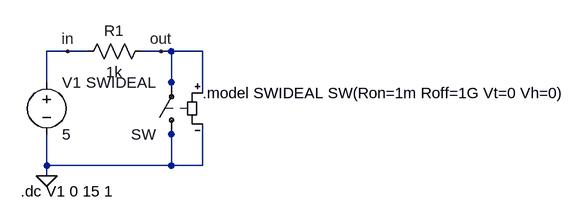
[diagram p0: schematic ideal_diodea.asc]
ideal_diodea.asc, the LTspice schematic file:
Version 4.1
SHEET 1 956 680
WIRE 144 80 112 80
WIRE 176 80 144 80
WIRE 288 80 256 80
WIRE 304 80 288 80
WIRE 352 80 304 80
WIRE 112 128 112 80
WIRE 304 128 304 80
WIRE 304 144 304 128
WIRE 352 144 352 80
WIRE 304 208 304 192
WIRE 112 256 112 208
WIRE 304 256 304 208
WIRE 304 256 112 256
WIRE 352 256 352 192
WIRE 352 256 304 256
WIRE 112 272 112 256
FLAG 112 272 0
FLAG 144 80 in
FLAG 288 80 out
SYMBOL res 272 64 R90
WINDOW 0 0 56 VBottom 2
WINDOW 3 32 56 VTop 2
SYMATTR InstName R1
SYMATTR Value 1k
SYMBOL voltage 112 112 R0
SYMATTR InstName V1
SYMATTR Value 5
SYMBOL sw 304 224 R180
SYMATTR InstName SW
SYMATTR Value SWIDEAL
TEXT 72 296 Left 2 !.dc V1 0 15 1
TEXT 352 144 Left 2 !.model SWIDEAL SW(Ron=1m Roff=1G Vt=0 Vh=0)

The netlist it stands for:
* ideal_diodea.asc
R1 out in 1k
V1 in 0 5
SW 0 out out 0 SWIDEAL
.dc V1 0 15 1
.model SWIDEAL SW(Ron=1m Roff=1G Vt=0 Vh=0)
.backanno
.end